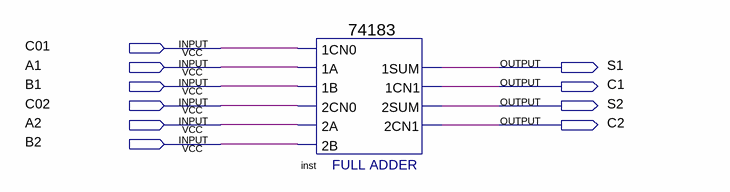
[diagram p0: schematic sheet]
// Quartus schematic 2fullAdd.bdf as structural Verilog: 1 symbols, 10 pins
module \2fullAdd  (
  input  C01,
  input  A1,
  input  B1,
  input  C02,
  input  A2,
  input  B2,
  output S1,
  output C1,
  output S2,
  output C2
);

  \74183  inst (
    .\2CN0 (C02), .\2A (A2), .\1B (B1), .\1A (A1), .\2B (B2), .\1CN0 (C01), .\1CN1 (C1), .\2SUM (S2),
    .\2CN1 (C2), .\1SUM (S1));
endmodule
